# Altium schematic sheet sub_Sch.SchDoc
size A4
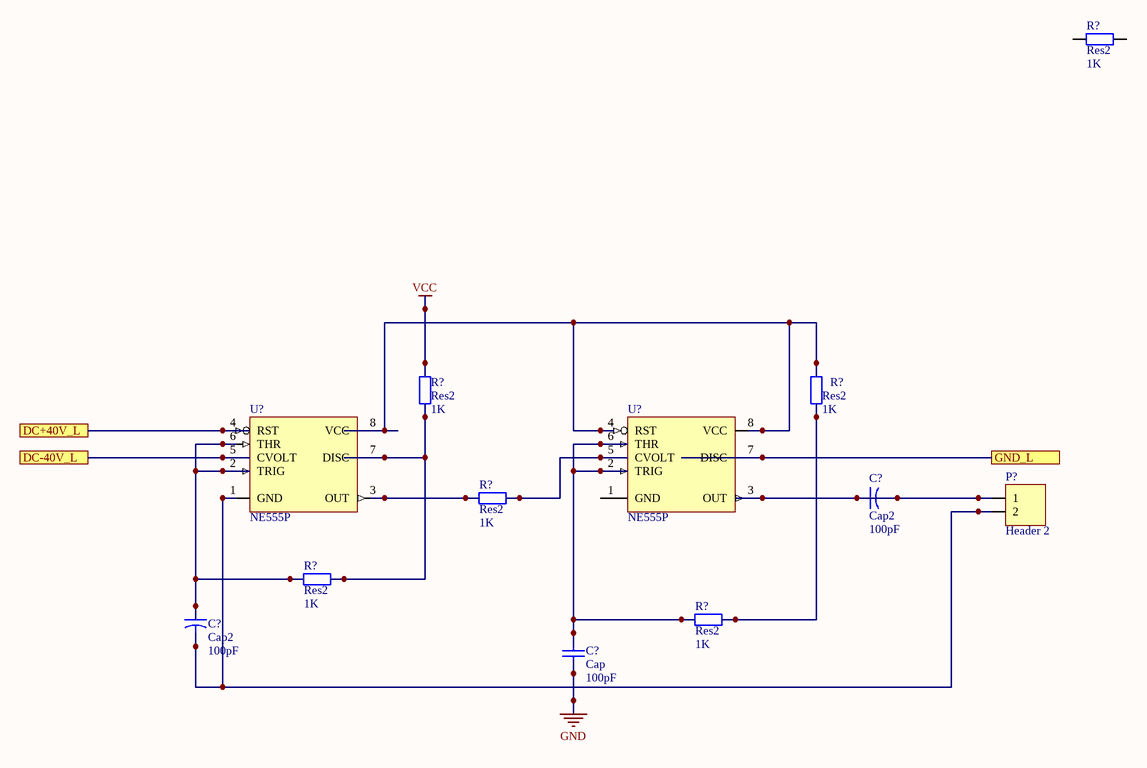
[diagram p0: sub_Sch.SchDoc]

## Parts
(Parts that share a designator on the sheet are numbered #1, #2 ... from top to bottom, then left to right.)
C?#1  Cap2  value 100pF  [CAPR5-4X5]
C?#2  Cap2  value 100pF  [CAPR5-4X5]
C?#3  Cap  value 100pF  [RAD-0.3]
P?  Header 2  [HDR1X2]
R?#1  Res2  value 1K  [AXIAL-0.4]
R?#2  Res2  value 1K  [AXIAL-0.4]
R?#3  Res2  value 1K  [AXIAL-0.4]
R?#4  Res2  value 1K  [AXIAL-0.4]
R?#5  Res2  value 1K  [AXIAL-0.4]
R?#6  Res2  value 1K  [AXIAL-0.4]
U?#1  NE555P  [P008]
U?#2  NE555P  [P008]

## Ports
DC+40V_L, DC-40V_L, GND_L

## Nets
GND: C?#3.1
VCC: R?#2.2
DC+40V_L: U?#1.4(RST) ; port DC+40V_L
DC-40V_L: U?#1.5(CVOLT) ; port DC-40V_L
GND_L: U?#2.7(DISC) ; port GND_L
NetC?#1_1: C?#1.1 C?#1.2 P?.1 U?#2.3(OUT)
NetC?#2_1: C?#2.1 R?#5.1 U?#1.2(TRIG) U?#1.6(THR)
NetC?#2_2: C?#2.2 P?.2 U?#1.1(GND)
NetC?#3_2: C?#3.2 R?#6.2 U?#2.2(TRIG) U?#2.6(THR)
NetR?#2_1: R?#2.1 R?#5.2 U?#1.7(DISC)
NetR?#3_1: R?#3.1 R?#6.1
NetR?#3_2: R?#3.2 U?#1.8(VCC) U?#2.4(RST) U?#2.8(VCC)
NetR?#4_1: R?#4.1 U?#1.3(OUT)
NetR?#4_2: R?#4.2 U?#2.5(CVOLT)

Not connected (* = marked no-connect by the designer): R?#1 1 2; U?#2 1(GND)

## Library data of the parts
C?#1 C?#2 = Cap2: Capacitor; Published: 23-Sep-2002; PackageReference: CAPR5-4X5; Publisher: Altium Limited
C?#3 = Cap: Capacitor; Published: 8-Jun-2000; LatestRevisionDate: 17-Jul-2002; LatestRevisionNote: Re-released for DXP Platform.; PackageReference: RAD-0.3; Publisher: Altium Limited
P? = Header 2: Header, 2-Pin; LatestRevisionDate: 17-Jul-2002; LatestRevisionNote: Re-released for DXP Platform.; Publisher: Altium Limited
R?#1-R?#6 = Res2: Resistor; Published: 8-Jun-2000; LatestRevisionDate: 17-Jul-2002; LatestRevisionNote: Re-released for DXP Platform.; PackageReference: AXIAL-0.4; Publisher: Altium Limited
U?#1 U?#2 = NE555P: Precision Timer; Published: 16-Jan-2001; LatestRevisionDate: 04-Mar-2005; LatestRevisionNote: Stylized 3D Model Added.; DatasheetVersion: Feb-1992; PackageVersion: Jun-1999; PackageReference: P008; Publisher: Altium Limited; PackageDescription: DIP; 8 Leads; Row Spacing 7.62 mm; Pitch 2.54 mm; Code_JEDEC: MO-001-AN; ComponentLink1Description: Manufacturer Link; ComponentLink1URL: http://www.ti.com/; ComponentLink2Description: Datasheet; ComponentLink2URL: http://www-s.ti.com/sc/ds/ne555.pdf